# EAGLE design 407_led_ring (EAGLE 9.6.2)
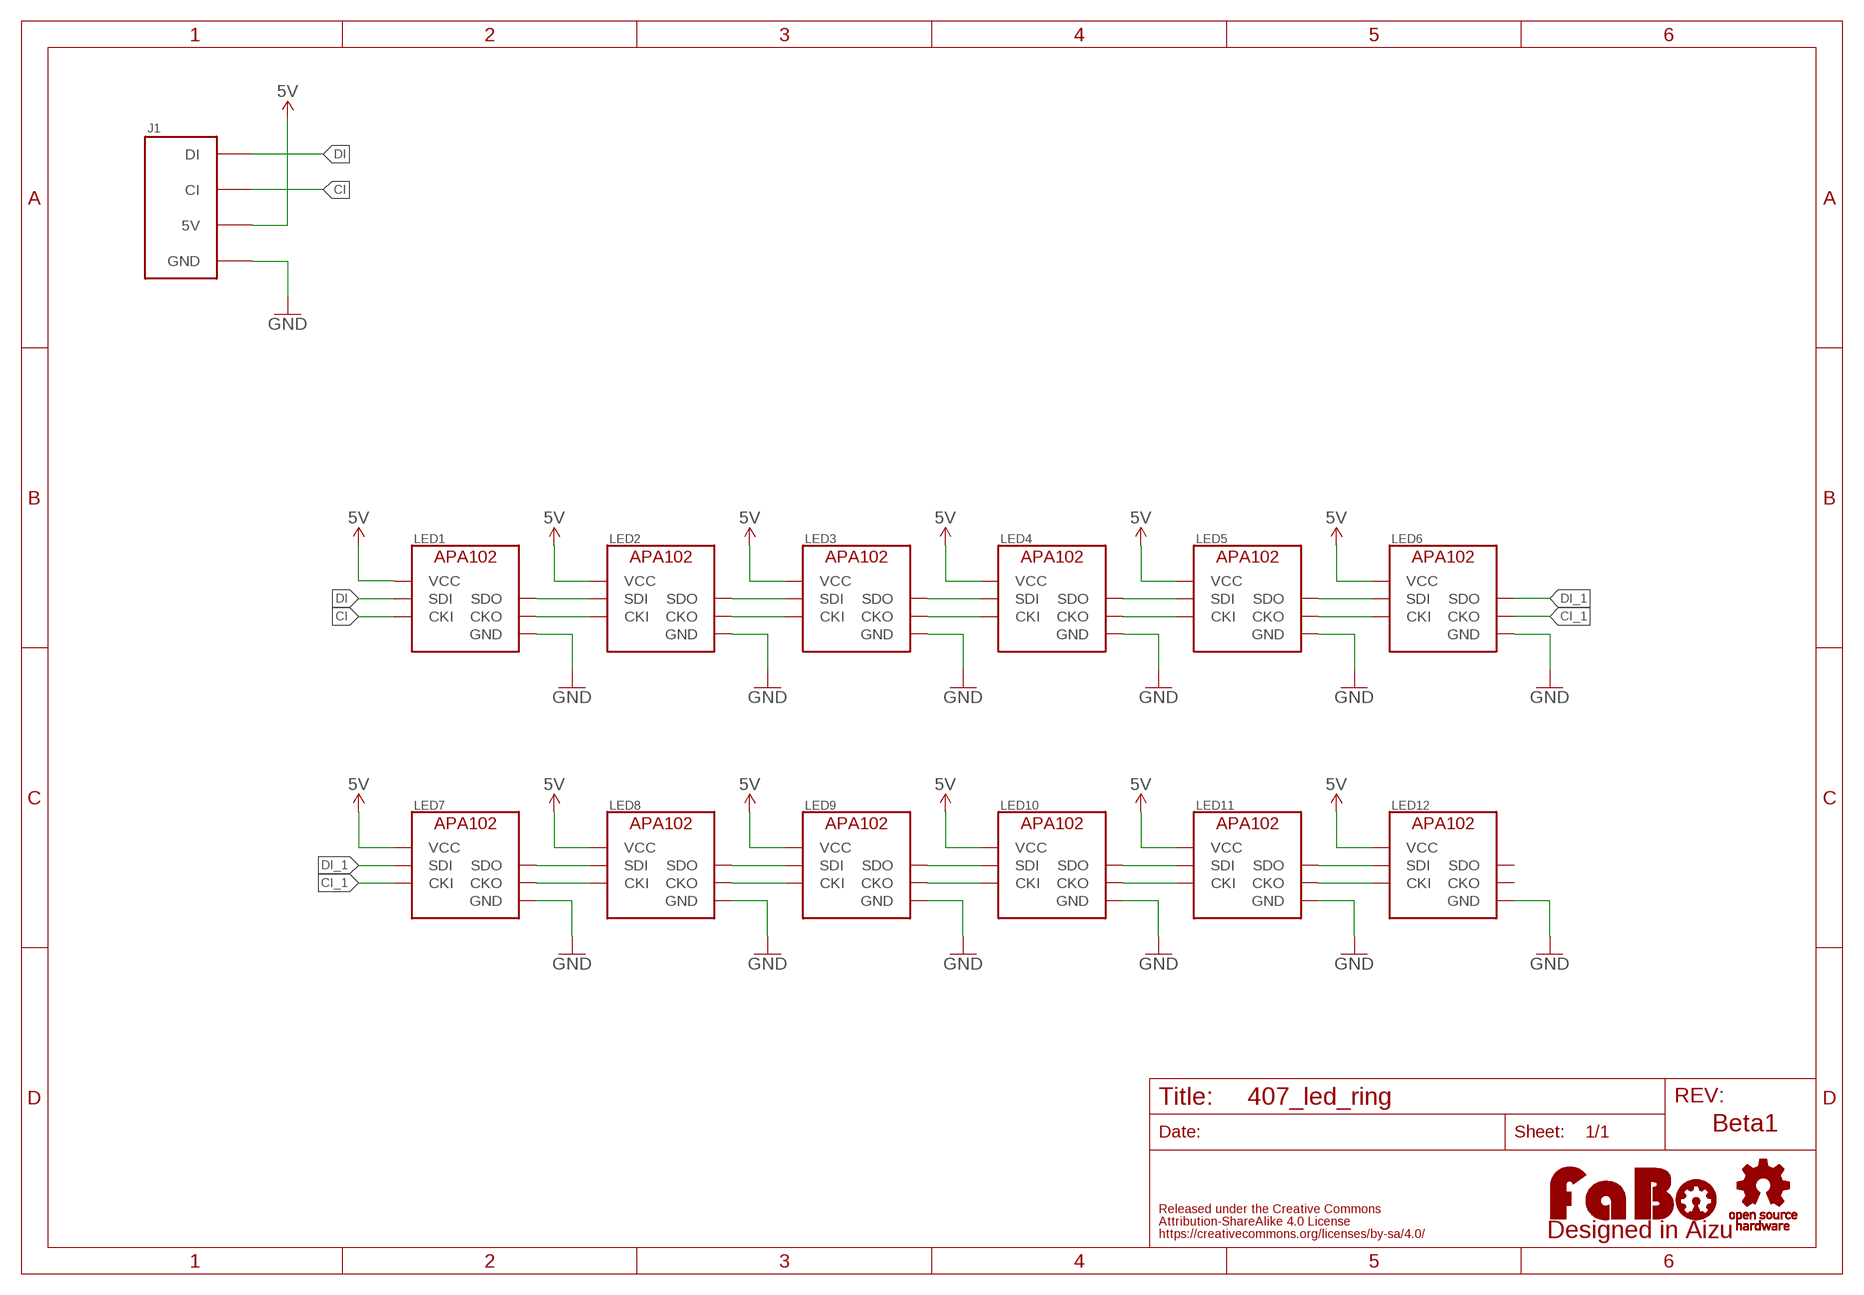
[diagram p0: schematic, sheet 1]

## Parts
J1  FABO_BRICK_SPI_LED-S04B-PASK-2  [FABO_BRICK_SPI_LED_S04B-PASK-2]
LED1  APA102_IPIXEL  [APA102_2020]
LED2  APA102_IPIXEL  [APA102_2020]
LED3  APA102_IPIXEL  [APA102_2020]
LED4  APA102_IPIXEL  [APA102_2020]
LED5  APA102_IPIXEL  [APA102_2020]
LED6  APA102_IPIXEL  [APA102_2020]
LED7  APA102_IPIXEL  [APA102_2020]
LED8  APA102_IPIXEL  [APA102_2020]
LED9  APA102_IPIXEL  [APA102_2020]
LED10  APA102_IPIXEL  [APA102_2020]
LED11  APA102_IPIXEL  [APA102_2020]
LED12  APA102_IPIXEL  [APA102_2020]
LOGO1  LOGO_OSHW-S_BOTTOM  [LOGO_OSHW_S_BOTTOM]
LOGO2  LOGO_FABO-S  [LOGO_FABO_S]

## Nets
5V: J1.5V LED1.VCC LED2.VCC LED3.VCC LED4.VCC LED5.VCC LED6.VCC LED7.VCC LED8.VCC LED9.VCC LED10.VCC LED11.VCC LED12.VCC
CI: J1.CI LED1.CKI
CI_1: LED6.CKO LED7.CKI
DI: J1.DI LED1.SDI
DI_1: LED6.SDO LED7.SDI
GND: J1.GND LED1.GND LED2.GND LED3.GND LED4.GND LED5.GND LED6.GND LED7.GND LED8.GND LED9.GND LED10.GND LED11.GND LED12.GND
N$1: LED1.SDO LED2.SDI
N$2: LED1.CKO LED2.CKI
N$3: LED2.SDO LED3.SDI
N$4: LED2.CKO LED3.CKI
N$5: LED3.SDO LED4.SDI
N$6: LED3.CKO LED4.CKI
N$7: LED4.SDO LED5.SDI
N$8: LED4.CKO LED5.CKI
N$9: LED5.SDO LED6.SDI
N$10: LED5.CKO LED6.CKI
N$11: LED7.SDO LED8.SDI
N$12: LED7.CKO LED8.CKI
N$13: LED8.SDO LED9.SDI
N$14: LED8.CKO LED9.CKI
N$15: LED9.SDO LED10.SDI
N$16: LED9.CKO LED10.CKI
N$17: LED10.SDO LED11.SDI
N$18: LED10.CKO LED11.CKI
N$19: LED11.SDO LED12.SDI
N$20: LED11.CKO LED12.CKI
Unconnected: LED12.CKO LED12.SDO

## Notes on the sheet
- Beta1

## Library data of the parts
J1 = FaBo-Template:FABO_BRICK_SPI_LED
LED1-LED12 = FaBo-LED:APA102
LOGO1 = FaBo-Logo:LOGO_OSHW
LOGO2 = FaBo-Logo:LOGO_FABO

## Board
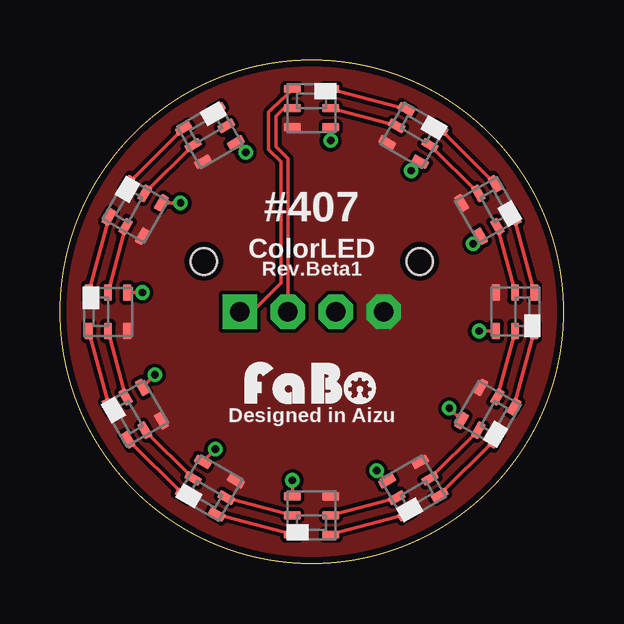
[diagram p1: board, top side]
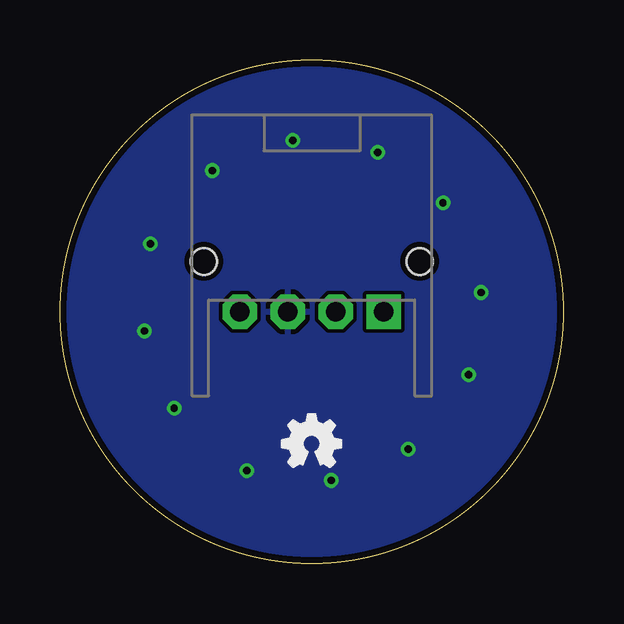
[diagram p2: board, bottom side, seen from below]

Size 21 x 21 mm. Coordinates in mm from the lower left corner, seen from the top.
Outline: circle at 10.5,10.5 radius 10.5
Copper layers (1*16): Top 0.035mm / dielectric 1.6mm / Bottom 0.035mm
Design rules "PCBway": minimum track width 6mil, minimum drill 12mil, track to track 6mil, track to pad 6mil, pad to pad 6mil, via to via 6mil, smd to smd 6mil, copper to edge 10mil, drill to drill 10mil, minimum pad ring 10mil, minimum via ring 6mil, stop-mask expansion 2mil, vias tented up to drill 100mil, thermal gap 8mil

### Footprints (pad centres in the part's own frame; a part is rotated, then mirrored left to right if it is on the bottom)
FABO_BRICK_SPI_LED_S04B-PASK-2 = drill 0.8 pad 1.422 octagon: 5V -1,0; CI 1,0; GND -3,0 | drill 0.8 pad 1.422 square: DI 3,0 | hole 1.1: 4.5,2.1; -4.5,2.1
APA102_2020 = smd 0.7 x 0.35: CKI 0.8,0; CKO -0.8,0; GND 0.8,0.8; SDI 0.8,-0.8; SDO -0.8,-0.8; VCC -0.8,0.8

### Placement (x,y rotation side)
J1  10.5,10.5 0 bottom
LED1  10.49,18.99 180 top
LED2  14.74,17.85 150 top
LED3  17.84,14.75 120 top
LED4  18.98,10.5 90 top
LED5  17.84,6.25 60 top
LED6  14.74,3.15 30 top
LED7  10.49,2.01 0 top
LED8  6.25,3.15 330 top
LED9  3.14,6.25 300 top
LED10  2,10.5 270 top
LED11  3.14,14.75 240 top
LED12  6.25,17.85 210 top
LOGO1  10.5,5 0 top
LOGO2  10.5,6.5 0 top

### Tracks (layer width: path | path; a pad name or v marks a point on that pad's centre or on a via)
5V  (via drill 0.3)
  Top 0.152: LED1.VCC v11.29,17.64 | LED2.VCC v14.65,16.38 | LED3.VCC v17.23,13.34 | LED4.VCC v17.48,9.7 | LED5.VCC v16.24,6.48 | LED6.VCC v13.21,3.88 | LED7.VCC v9.69,3.47 | LED8.VCC v6.48,4.76 | LED9.VCC v3.96,7.87 | LED10.VCC v3.43,11.3 | LED11.VCC v5.03,15.04 | LED12.VCC v7.75,17.15
  pour Bottom (isolate 0.152, rank 3): 10.5,21 arc-90 21,10.5 arc-90 10.5,0 arc-90 0,10.5 arc-90
CI
  Top 0.152: LED1.CKI 9.34,18.99 9.01,18.66 9.01,17.39 9.52,16.88 9.52,10.52 J1.CI
CI_1
  Top 0.152: LED6.CKO LED7.CKI
DI
  Top 0.152: J1.DI 8.01,10.5 9.21,11.7 9.21,16.76 8.7,17.27 8.7,18.82 9.28,19.39 9.29,19.39 LED1.SDI
DI_1
  Top 0.152: LED6.SDO LED7.SDI
GND
  pour Top (isolate 0.152, rank 3, no thermals): 10.5,21 arc-90 21,10.5 arc-90 10.5,0 arc-90 0,10.5 arc-90
N$1
  Top 0.152: LED1.SDO LED2.SDI
N$2
  Top 0.152: LED1.CKO LED2.CKI
N$3
  Top 0.152: LED2.SDO LED3.SDI
N$4
  Top 0.152: LED2.CKO LED3.CKI
N$5
  Top 0.152: LED3.SDO LED4.SDI
N$6
  Top 0.152: LED3.CKO LED4.CKI
N$7
  Top 0.152: LED4.SDO LED5.SDI
N$8
  Top 0.152: LED4.CKO LED5.CKI
N$9
  Top 0.152: LED5.SDO LED6.SDI
N$10
  Top 0.152: LED5.CKO LED6.CKI
N$11
  Top 0.152: LED7.SDO LED8.SDI
N$12
  Top 0.152: LED7.CKO LED8.CKI
N$13
  Top 0.152: LED8.SDO LED9.SDI
N$14
  Top 0.152: LED8.CKO LED9.CKI
N$15
  Top 0.152: LED9.SDO LED10.SDI
N$16
  Top 0.152: LED9.CKO LED10.CKI
N$17
  Top 0.152: LED10.SDO LED11.SDI
N$18
  Top 0.152: LED10.CKO LED11.CKI
N$19
  Top 0.152: LED11.SDO LED12.SDI
N$20
  Top 0.152: LED11.CKO LED12.CKI

### Text on the board
tPlace: #407 | ColorLED | Rev.Beta1 | Designed in Aizu